# Altium schematic sheet AutoMOO_Schematic.SchDoc: PIC Exploration Board
size A; Author: Adam Campbell; DrawnBy: Adam Campbell; Engineer: Adam Campbell; Revision: A; SheetNumber: 1; SheetTotal: 1
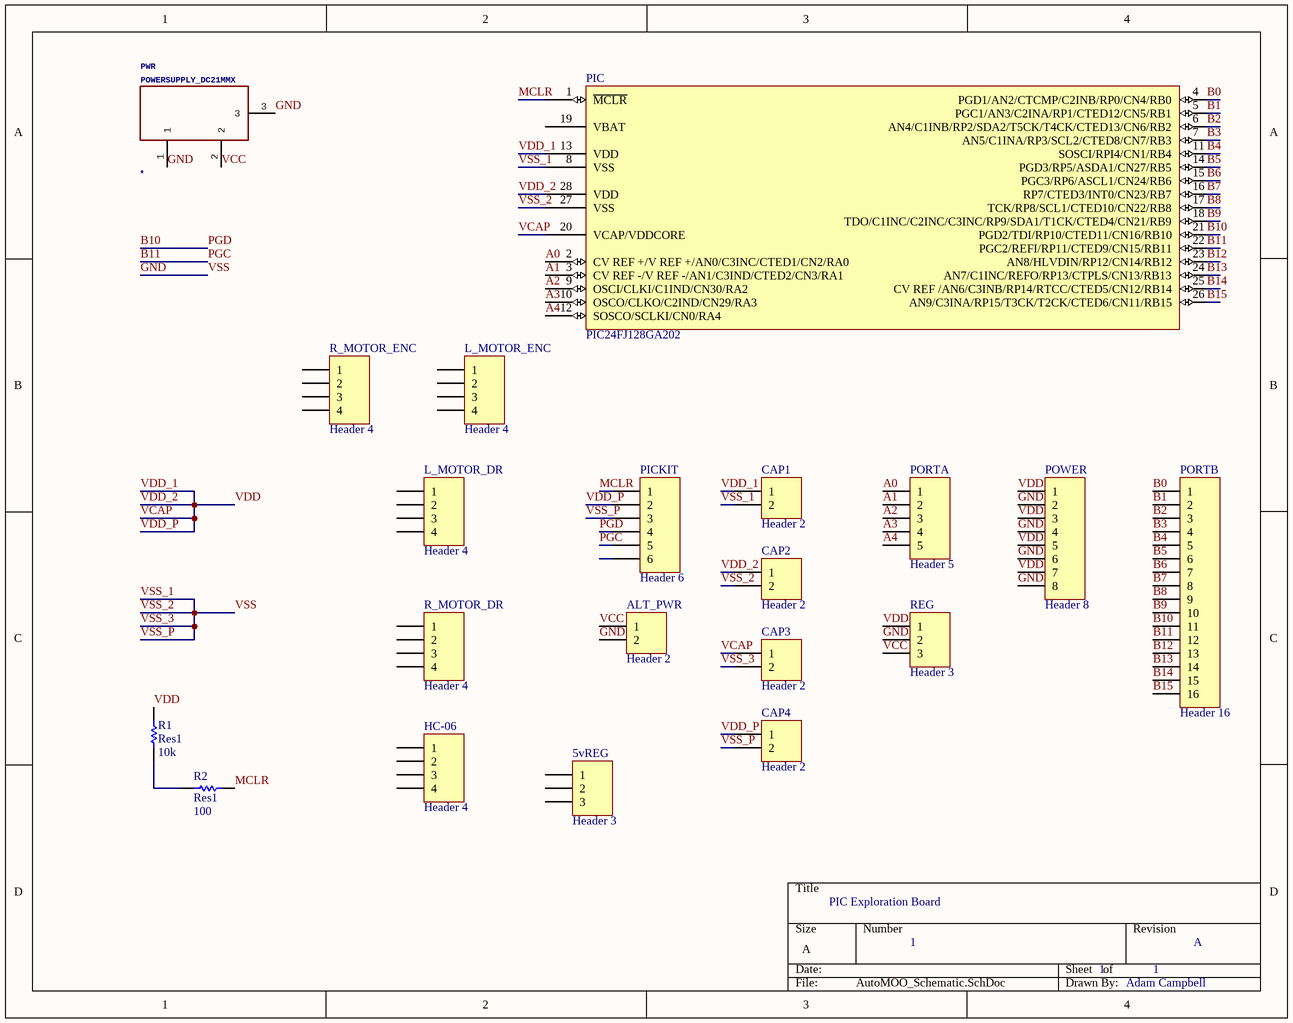
[diagram p0: AutoMOO_Schematic.SchDoc]

## Parts
5vREG  Header 3  [HDR1X3]
ALT_PWR  Header 2  [HDR1X2]
CAP1  Header 2  [HDR1X2]
CAP2  Header 2  [HDR1X2]
CAP3  Header 2  [HDR1X2]
CAP4  Header 2  [HDR1X2]
HC-06  Header 4  [HDR1X4]
L_MOTOR_DR  Header 4  [HDR1X4]
L_MOTOR_ENC  Header 4  [HDR1X4]
PIC  PIC24FJ128GA202  [SPDIP300-SP28]
PICKIT  Header 6  [HDR1X6]
PORTA  Header 5  [HDR1X5]
PORTB  Header 16  [HDR1X16]
POWER  Header 8  [HDR1X8]
PWR  POWERSUPPLY_DC21MMX  [POWERSUPPLY]
R1  Res1  value 10k  [AXIAL-0.3]
R2  Res1  value 100  [AXIAL-0.3]
R_MOTOR_DR  Header 4  [HDR1X4]
R_MOTOR_ENC  Header 4  [HDR1X4]
REG  Header 3  [HDR1X3]

## Nets
A0: PIC.2(CV_REF_+/V_REF_+/AN0/C3INC/CTED1/CN2/RA0) PORTA.1
A1: PIC.3(CV_REF_-/V_REF_-/AN1/C3IND/CTED2/CN3/RA1) PORTA.2
A2: PIC.9(OSCI/CLKI/C1IND/CN30/RA2) PORTA.3
A3: PIC.10(OSCO/CLKO/C2IND/CN29/RA3) PORTA.4
A4: PIC.12(SOSCO/SCLKI/CN0/RA4) PORTA.5
B0: PIC.4(PGD1/AN2/CTCMP/C2INB/RP0/CN4/RB0) PORTB.1
B1: PIC.5(PGC1/AN3/C2INA/RP1/CTED12/CN5/RB1) PORTB.2
B2: PIC.6(AN4/C1INB/RP2/SDA2/T5CK/T4CK/CTED13/CN6/RB2) PORTB.3
B3: PIC.7(AN5/C1INA/RP3/SCL2/CTED8/CN7/RB3) PORTB.4
B4: PIC.11(SOSCI/RPI4/CN1/RB4) PORTB.5
B5: PIC.14(PGD3/RP5/ASDA1/CN27/RB5) PORTB.6
B6: PIC.15(PGC3/RP6/ASCL1/CN24/RB6) PORTB.7
B7: PIC.16(RP7/CTED3/INT0/CN23/RB7) PORTB.8
B8: PIC.17(TCK/RP8/SCL1/CTED10/CN22/RB8) PORTB.9
B9: PIC.18(TDO/C1INC/C2INC/C3INC/RP9/SDA1/T1CK/CTED4/CN21/RB9) PORTB.10
B10: PIC.21(PGD2/TDI/RP10/CTED11/CN16/RB10) PICKIT.4 PORTB.11  [also labelled PGD]
B11: PIC.22(PGC2/REFI/RP11/CTED9/CN15/RB11) PICKIT.5 PORTB.12  [also labelled PGC]
B12: PIC.23(AN8/HLVDIN/RP12/CN14/RB12) PORTB.13
B13: PIC.24(AN7/C1INC/REFO/RP13/CTPLS/CN13/RB13) PORTB.14
B14: PIC.25(CV_REF_/AN6/C3INB/RP14/RTCC/CTED5/CN12/RB14) PORTB.15
B15: PIC.26(AN9/C3INA/RP15/T3CK/T2CK/CTED6/CN11/RB15) PORTB.16
GND: ALT_PWR.2 CAP1.2 CAP2.2 CAP3.2 CAP4.2 PIC.8(VSS) PIC.27(VSS) PICKIT.3 POWER.2 POWER.4 POWER.6 POWER.8 PWR.1 PWR.3 REG.2  [also labelled VSS, VSS_1, VSS_2, VSS_3, VSS_P]
MCLR: PIC.1(~{MCLR}) PICKIT.1 R2.2
VCAP: CAP1.1 CAP2.1 CAP3.1 CAP4.1 PIC.13(VDD) PIC.20(VCAP/VDDCORE) PIC.28(VDD) PICKIT.2 POWER.1 POWER.3 POWER.5 POWER.7 R1.2 REG.1  [also labelled VDD, VDD_1, VDD_2, VDD_P]
VCC: ALT_PWR.1 PWR.2 REG.3
NetR1_1: R1.1 R2.1

Not connected (* = marked no-connect by the designer): 5vREG 1 2 3; HC-06 1 2 3 4; L_MOTOR_DR 1 2 3 4; L_MOTOR_ENC 1 2 3 4; PIC 19(VBAT); PICKIT 6; R_MOTOR_DR 1 2 3 4; R_MOTOR_ENC 1 2 3 4

## Library data of the parts
5vREG REG = Header 3: Header, 3-Pin; LatestRevisionDate: 17-Jul-2002; LatestRevisionNote: Re-released for DXP Platform.; Publisher: Altium Limited
ALT_PWR CAP1-CAP4 = Header 2: Header, 2-Pin; LatestRevisionDate: 17-Jul-2002; LatestRevisionNote: Re-released for DXP Platform.; Publisher: Altium Limited
HC-06 L_MOTOR_DR L_MOTOR_ENC R_MOTOR_DR R_MOTOR_ENC = Header 4: Header, 4-Pin; LatestRevisionDate: 17-Jul-2002; LatestRevisionNote: Re-released for DXP Platform.; Publisher: Altium Limited
PICKIT = Header 6: Header, 6-Pin; LatestRevisionDate: 17-Jul-2002; LatestRevisionNote: Re-released for DXP Platform.; Publisher: Altium Limited
PORTA = Header 5: Header, 5-Pin; LatestRevisionDate: 17-Jul-2002; LatestRevisionNote: Re-released for DXP Platform.; Publisher: Altium Limited
PORTB = Header 16: Header, 16-Pin; LatestRevisionDate: 17-Jul-2002; LatestRevisionNote: Re-released for DXP Platform.; Publisher: Altium Limited
POWER = Header 8: Header, 8-Pin; LatestRevisionDate: 17-Jul-2002; LatestRevisionNote: Re-released for DXP Platform.; Publisher: Altium Limited
PWR = POWERSUPPLY: GateName_1: G$1; SymbolName_1: POWERSUPPLY_DC21PWR; DeviceName: X; LibraryName: SmartPrj; DeviceSetName: POWERSUPPLY_DC21MM; NAME: *
R1 R2 = Res1: Resistor; Published: 8-Jun-2000; LatestRevisionDate: 17-Jul-2002; LatestRevisionNote: Re-released for DXP Platform.; PackageReference: AXIAL-0.3; Publisher: Altium Limited; PackageDescription: Axial Device, Thru-Hole; 2 Leads; 0.3 in Pin Spacing